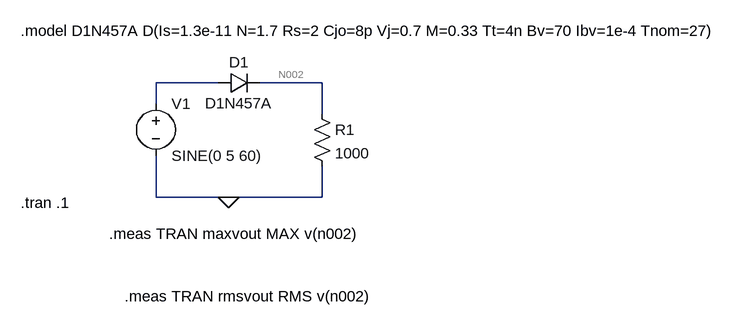
[diagram p0: schematic Circuit1.asc]
Circuit1.asc, the LTspice schematic file:
Version 4.1
SHEET 1 1144 680
WIRE 192 112 96 112
WIRE 352 112 256 112
WIRE 96 144 96 112
WIRE 352 160 352 112
WIRE 96 288 96 224
WIRE 208 288 96 288
WIRE 352 288 352 240
WIRE 352 288 208 288
FLAG 208 288 0
SYMBOL voltage 96 128 R0
WINDOW 123 0 0 Left 0
WINDOW 39 0 0 Left 0
SYMATTR InstName V1
SYMATTR Value SINE(0 5 60)
SYMBOL diode 192 128 R270
WINDOW 0 32 32 VTop 2
WINDOW 3 0 32 VBottom 2
SYMATTR InstName D1
SYMATTR Value D1N457A
SYMBOL res 336 144 R0
SYMATTR InstName R1
SYMATTR Value 1000
TEXT -112 32 Left 2 !.model D1N457A D(Is=1.3e-11 N=1.7 Rs=2 Cjo=8p Vj=0.7 M=0.33 Tt=4n Bv=70 Ibv=1e-4 Tnom=27)
TEXT -112 296 Left 2 !.tran .1
TEXT 24 344 Left 2 !.meas TRAN maxvout MAX v(n002)
TEXT 48 440 Left 2 !.meas TRAN rmsvout RMS v(n002)

The netlist it stands for:
* Circuit1.asc
V1 N001 0 SINE(0 5 60)
D1 N001 N002 D1N457A
R1 N002 0 1000
.model D D
.lib standard.dio
.model D1N457A D(Is=1.3e-11 N=1.7 Rs=2 Cjo=8p Vj=0.7 M=0.33 Tt=4n Bv=70 Ibv=1e-4 Tnom=27)
.tran .1
.meas TRAN maxvout MAX v(n002)
.meas TRAN rmsvout RMS v(n002)
.backanno
.end